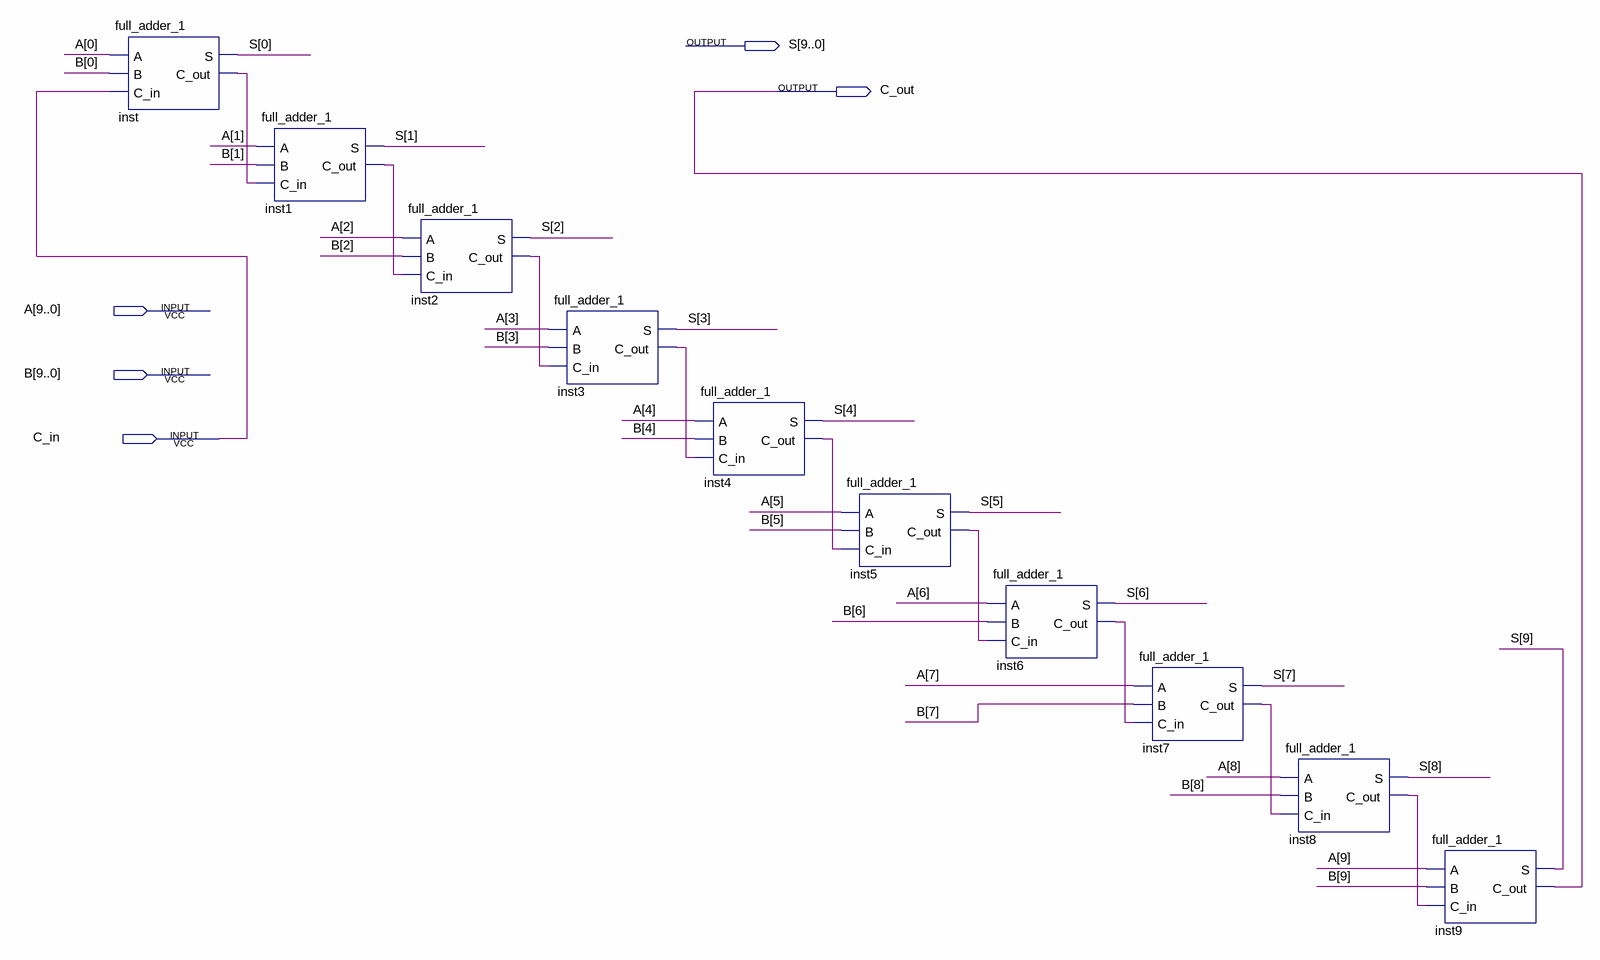
[diagram p0: schematic sheet]
// Quartus schematic full_adder_10.bdf as structural Verilog: 10 symbols, 5 pins
module full_adder_10 (
  input  [9:0] A,
  input  [9:0] B,
  input  C_in,
  output [9:0] S,
  output C_out
);

  wire inst1_c_out, inst2_c_out, inst3_c_out, inst4_c_out, inst5_c_out, inst6_c_out, inst7_c_out,
       inst8_c_out, inst_c_out;

  full_adder_1 inst (.A(A[0]), .B(B[0]), .C_in(C_in), .S(S[0]), .C_out(inst_c_out));
  full_adder_1 inst1 (.A(A[1]), .B(B[1]), .C_in(inst_c_out), .S(S[1]), .C_out(inst1_c_out));
  full_adder_1 inst2 (.A(A[2]), .B(B[2]), .C_in(inst1_c_out), .S(S[2]), .C_out(inst2_c_out));
  full_adder_1 inst3 (.A(A[3]), .B(B[3]), .C_in(inst2_c_out), .S(S[3]), .C_out(inst3_c_out));
  full_adder_1 inst4 (.A(A[4]), .B(B[4]), .C_in(inst3_c_out), .S(S[4]), .C_out(inst4_c_out));
  full_adder_1 inst5 (.A(A[5]), .B(B[5]), .C_in(inst4_c_out), .S(S[5]), .C_out(inst5_c_out));
  full_adder_1 inst6 (.A(A[6]), .B(B[6]), .C_in(inst5_c_out), .S(S[6]), .C_out(inst6_c_out));
  full_adder_1 inst7 (.A(A[7]), .B(B[7]), .C_in(inst6_c_out), .S(S[7]), .C_out(inst7_c_out));
  full_adder_1 inst8 (.A(A[8]), .B(B[8]), .C_in(inst7_c_out), .S(S[8]), .C_out(inst8_c_out));
  full_adder_1 inst9 (.A(A[9]), .B(B[9]), .C_in(inst8_c_out), .S(S[9]), .C_out(C_out));
endmodule
